# Altium schematic sheet powertrain.SchDoc
size B; DrawnBy: Hoang Pham; Engineer: Hoang Pham; SheetNumber: 2; SheetTotal: 4; DocumentName: powertrain
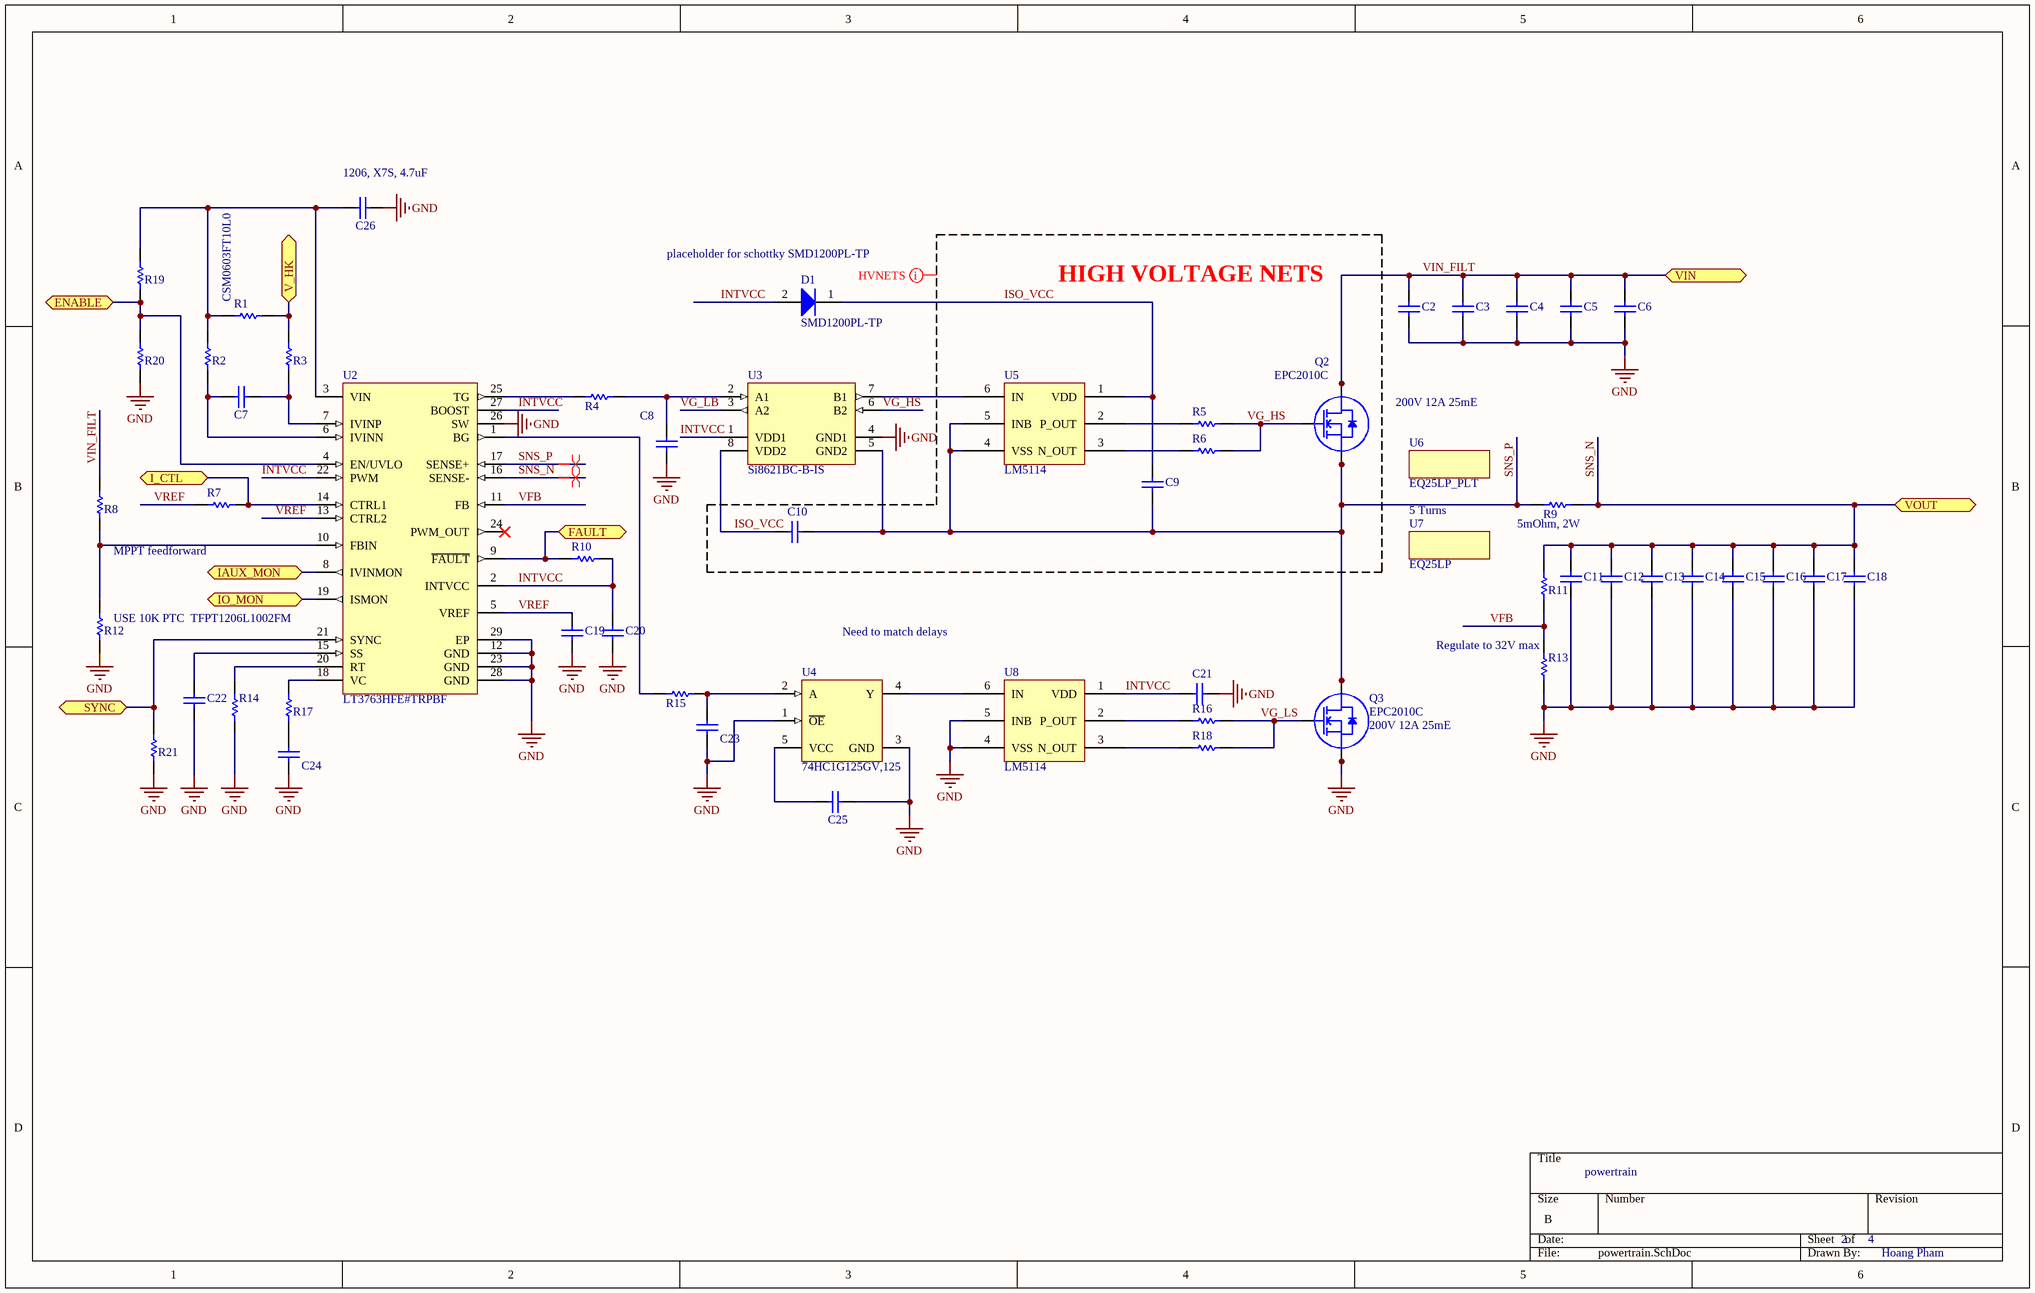
[diagram p0: powertrain.SchDoc]

## Parts
C2  CAP 10nF 200V 0603(1608)  [CAPC0603(1608)100_L]  (value not drawn)
C3  CAP 10nF 200V 0603(1608)  [CAPC0603(1608)100_L]  (value not drawn)
C4  CAP 10nF 200V 0603(1608)  [CAPC0603(1608)100_L]  (value not drawn)
C5  CAP 10nF 200V 0603(1608)  [CAPC0603(1608)100_L]  (value not drawn)
C6  CAP 10nF 200V 0603(1608)  [CAPC0603(1608)100_L]  (value not drawn)
C7  CAP 1uF 10V 0402(1005)  [CAPC0402(1005)60_N]  (value not drawn)
C8  CAP 1pF 10V 0402(1005)  [CAPC0402(1005)60_L]  (value not drawn)
C9  CAP 220nF 10V 0402(1005)  [CAPC0402(1005)60_M]  (value not drawn)
C10  CAP 220nF 10V 0402(1005)  [CAPC0402(1005)60_M]  (value not drawn)
C11  CAP 4.7uF 100V 2220(5750)  [CAPC2220(5750)280_M]  (value not drawn)
C12  CAP 4.7uF 100V 2220(5750)  [CAPC2220(5750)280_M]  (value not drawn)
C13  CAP 4.7uF 100V 2220(5750)  [CAPC2220(5750)280_M]  (value not drawn)
C14  CAP 4.7uF 100V 2220(5750)  [CAPC2220(5750)280_M]  (value not drawn)
C15  CAP 4.7uF 100V 2220(5750)  [CAPC2220(5750)280_M]  (value not drawn)
C16  CAP 4.7uF 100V 2220(5750)  [CAPC2220(5750)280_M]  (value not drawn)
C17  CAP 4.7uF 100V 2220(5750)  [CAPC2220(5750)280_M]  (value not drawn)
C18  CAP 4.7uF 100V 2220(5750)  [CAPC2220(5750)280_M]  (value not drawn)
C19  CAP 2.2uF 10V 0402(1005)  [CAPC0402(1005)60_N]  (value not drawn)
C20  CAP 22uF 10V 0805(2012)  [CAPC0805(2012)145_L]  (value not drawn)
C21  CAP 220nF 10V 0402(1005)  [CAPC0402(1005)60_M]  (value not drawn)
C22  CAP 10nF 10V 0402(1005)  [CAPC0402(1005)60_L]  (value not drawn)
C23  CAP 1pF 10V 0402(1005)  [CAPC0402(1005)60_L]  (value not drawn)
C24  CAP 4.7nF 10V 0402(1005)  [CAPC0402(1005)60_M]  (value not drawn)
C25  CAP 470nF 10V 0402(1005)  [CAPC0402(1005)60_N]  (value not drawn)
C26  CAP 1uF 100V 1206(3216)  [CAPC1206(3216)190_L]  (value not drawn)
D1  SMD1200PL-TP  [ONSC-SOD-123-2-425-04_V]
Q2  EPC2010C  value 200V 12A 25mE  [EPC2x200L]
Q3  EPC2010C  value 200V 12A 25mE  [EPC2x200L]
R1  CSM0603FT10L0  [RESC1608X40X30ML10T10]
R2  1K 1% 0402(1005)  [RESC0402(1005)_L]  (value not drawn)
R3  1K 1% 0402(1005)  [RESC0402(1005)_L]  (value not drawn)
R4  Jumper 0402(1005)  [RESC0402(1005)_N]  (value not drawn)
R5  Jumper 0402(1005)  [RESC0402(1005)_N]  (value not drawn)
R6  Jumper 0402(1005)  [RESC0402(1005)_N]  (value not drawn)
R7  10K 1% 0402(1005)  [RESC0402(1005)_N]  (value not drawn)
R8  475K 1% 0603(1608)  [RESC0603(1608)_M]  (value not drawn)
R9  Jumper 2010(5025)  [RESC2010(5025)_M]  (value not drawn)
R10  47K5 1% 0402(1005)  [RESC0402(1005)_M]  (value not drawn)
R11  255K 1% 0603(1608)  [RESC0603(1608)_N]  (value not drawn)
R12  10K 5% 1206(3216)  [RESC1206(3216)_M]  (value not drawn)
R13  10K 1% 0402(1005)  [RESC0402(1005)_N]  (value not drawn)
R14  90K9 1% 0402(1005)  [RESC0402(1005)_N]  (value not drawn)
R15  Jumper 0402(1005)  [RESC0402(1005)_N]  (value not drawn)
R16  Jumper 0402(1005)  [RESC0402(1005)_N]  (value not drawn)
R17  59K 1% 0402(1005)  [RESC0402(1005)_L]  (value not drawn)
R18  Jumper 0402(1005)  [RESC0402(1005)_N]  (value not drawn)
R19  69R8 1% 0402(1005)  [RESC0402(1005)_M]  (value not drawn)
R20  3K3 5% 0402(1005)  [RESC0402(1005)_L]  (value not drawn)
R21  10K 5% 0402(1005)  [RESC0402(1005)_N]  (value not drawn)
U2  LT3763HFE#TRPBF  [LT-FE-28-EPV-EB_N]
U3  Si8621BC-B-IS  [SLAB-SOIC-8-NB_M]
U4  74HC1G125GV,125  [NXP-SOT753_V]
U5  LM5114
U6  EQ25LP_PLT
U7  EQ25LP
U8  LM5114

## Blocks framed on the sheet
HIGH VOLTAGE NETS: C9 C10 Q2 R5 R6 U5

## Ports
ENABLE, FAULT, I_CTL, IAUX_MON, IO_MON, SYNC, V_HK, VIN, VOUT

## Nets
GND: C2.1 C3.1 C4.1 C5.1 C6.1 C8.1 C11.1 C12.1 C13.1 C14.1 C15.1 C16.1 C17.1 C18.1 C19.1 C20.1 C21.1 C22.1 C23.1 C24.1 C25.2 C26.2 Q3.2(SS) Q3.4(SP1) Q3.6(SP2) R12.1 R13.1 R14.1 R20.1 R21.1 U2.12(GND) U2.23(GND) U2.26(SW) U2.28(GND) U2.29(EP) U3.4(GND1) U4.1(~{OE}) U4.3(GND) U8.4(VSS) U8.5(INB)
ENABLE: R19.1 R20.2 U2.4(EN/UVLO) ; port ENABLE
FAULT: R10.1 U2.9(~{FAULT}) ; port FAULT
I_CTL: R7.1 U2.14(CTRL1) ; port I_CTL
IAUX_MON: U2.8(IVINMON) ; port IAUX_MON
INTVCC: C20.2 C21.2 D1.2(A) R10.2 U2.2(INTVCC) U2.22(PWM) U2.27(BOOST) U3.1(VDD1) U8.1(VDD)
IO_MON: U2.19(ISMON) ; port IO_MON
ISO_VCC: C9.2 C10.2 D1.1(K) U3.8(VDD2) U5.1(VDD)
SNS_N: C11.2 C12.2 C13.2 C14.2 C15.2 C16.2 C17.2 C18.2 R9.2 R11.2 U2.16(SENSE-) ; port VOUT
SNS_P: C9.1 C10.1 Q2.2(SS) Q2.4(SP1) Q2.6(SP2) Q3.3(D1) Q3.5(D2) Q3.7(D3) R9.1 U2.17(SENSE+) U3.5(GND2) U5.4(VSS) U5.5(INB)
SYNC: R21.2 U2.21(SYNC) ; port SYNC
V_HK: R1.2 R3.2 ; port V_HK
VFB: R11.1 R13.2 U2.11(FB)
VG_HS: Q2.1(G) R5.2 R6.2 U3.6(B2)
VG_LB: U3.3(A2)
VG_LS: Q3.1(G) R16.2 R18.2
VIN_FILT: C2.2 C3.2 C4.2 C5.2 C6.2 Q2.3(D1) Q2.5(D2) Q2.7(D3) R8.2 ; port VIN
VREF: C19.2 R7.2 U2.5(VREF) U2.13(CTRL2)
NetC7_1: C7.1 R2.1 U2.6(IVINN)
NetC7_2: C7.2 R3.1 U2.7(IVINP)
NetC8_2: C8.2 R4.2 U3.2(A1)
NetC22_2: C22.2 U2.15(SS)
NetC23_2: C23.2 R15.2 U4.2(A)
NetC24_2: C24.2 R17.1
NetC25_1: C25.1 U4.5(VCC)
NetC26_1: C26.1 R1.1 R2.2 R19.2 U2.3(VIN)
NetR4_1: R4.1 U2.25(TG)
NetR5_1: R5.1 U5.2(P_OUT)
NetR6_1: R6.1 U5.3(N_OUT)
NetR8_1: R8.1 R12.2 U2.10(FBIN)
NetR14_2: R14.2 U2.20(RT)
NetR15_1: R15.1 U2.1(BG)
NetR16_1: R16.1 U8.2(P_OUT)
NetR17_2: R17.2 U2.18(VC)
NetR18_1: R18.1 U8.3(N_OUT)
NetU3_7: U3.7(B1) U5.6(IN)
NetU4_4: U4.4(Y) U8.6(IN)

Not connected (* = marked no-connect by the designer): U2 24(PWM_OUT)*

## Layout directives
differential pair: SNS_N, SNS_P
net class Undefined: (no net found under the mark)

## Notes on the sheet
- (near C26) 1206, X7S, 4.7uF
- (near D1) placeholder for schottky SMD1200PL-TP
- MPPT feedforward
- 5 Turns
- (near R9) 5mOhm, 2W
- (near R12) USE 10K PTC  TFPT1206L1002FM
- Need to match delays
- (near R13) Regulate to 32V max

## Library data of the parts
C2-C6 = CMP-1035-02328-1: CAP 10nF 200V ±10% 0603 (1608 Metric) Thickness 1mm SMD; Case-Metric: 1608; Tolerance: Â±10%; Case-EIA: 0603; Technology: SMT; Rated Voltage: 200 V; Value: 10nF; Max Thickness: 1 mm
C7 = CMP-1034-02116-1: CAP 1uF 10V ±10% 0402 (1005 Metric) Thickness 0.6mm SMD; Tolerance: Â±10%; Case-Metric: 1005; Case-EIA: 0402; Value: 1uF; Technology: SMT; Max Thickness: 0.6 mm; Rated Voltage: 10 V
C8 C23 = CMP-1034-00047-1: CAP 1pF 10V ±0.1pF 0402 (1005 Metric) Thickness 0.6mm SMD; Tolerance: Â±0.1pF; Case-EIA: 0402; Case-Metric: 1005; Value: 1pF; Max Thickness: 0.6 mm; Technology: SMT; Rated Voltage: 10 V
C9 C10 C21 = CMP-1034-02086-1: CAP 220nF 10V ±10% 0402 (1005 Metric) Thickness 0.6mm SMD; Tolerance: Â±10%; Case-Metric: 1005; Case-EIA: 0402; Rated Voltage: 10 V; Technology: SMT; Max Thickness: 0.6 mm; Value: 220nF
C11-C18 = CMP-1042-00761-1: CAP 4.7uF 100V ±20% 2220 (5750 Metric) Thickness 2.8mm SMD; Tolerance: Â±20%; Case-EIA: 2220; Case-Metric: 5750; Max Thickness: 2.8 mm; Rated Voltage: 100 V; Technology: SMT; Value: 4.7uF
C19 = CMP-1034-02127-1: CAP 2.2uF 10V ±10% 0402 (1005 Metric) Thickness 0.6mm SMD; Case-EIA: 0402; Tolerance: Â±10%; Case-Metric: 1005; Technology: SMT; Rated Voltage: 10 V; Value: 2.2uF; Max Thickness: 0.6 mm
C20 = CMP-1036-04942-1: CAP 22uF 10V ±10% 0805 (2012 Metric) Thickness 1.45mm SMD; Case-EIA: 0805; Case-Metric: 2012; Tolerance: Â±10%; Rated Voltage: 10 V; Max Thickness: 1.45 mm; Value: 22uF; Technology: SMT
C22 = CMP-1034-01870-1: CAP 10nF 10V ±5% 0402 (1005 Metric) Thickness 0.6mm SMD; Tolerance: Â±5%; Case-EIA: 0402; Case-Metric: 1005; Value: 10nF; Technology: SMT; Max Thickness: 0.6 mm; Rated Voltage: 10 V
C24 = CMP-1034-01805-1: CAP 4.7nF 10V ±5% 0402 (1005 Metric) Thickness 0.6mm SMD; Tolerance: Â±5%; Case-EIA: 0402; Case-Metric: 1005; Technology: SMT; Value: 4.7nF; Rated Voltage: 10 V; Max Thickness: 0.6 mm
C25 = CMP-1034-02106-1: CAP 470nF 10V ±10% 0402 (1005 Metric) Thickness 0.6mm SMD; Tolerance: Â±10%; Case-EIA: 0402; Case-Metric: 1005; Value: 470nF; Technology: SMT; Rated Voltage: 10 V; Max Thickness: 0.6 mm
C26 = CMP-1037-04729-1: CAP 1uF 100V ±20% 1206 (3216 Metric) Thickness 1.9mm SMD; Case-EIA: 1206; Case-Metric: 3216; Tolerance: Â±20%; Max Thickness: 1.9 mm; Rated Voltage: 100 V; Value: 1uF; Technology: SMT
D1 = CMP-1054-00040-1: High Voltage Switching Diode, 2-Pin SOD-123, Pb-Free, Tape and Reel; Manufacturer: On Semiconductor; PartNumber: MMSD103T1G; IF Max (A): 0.2; Configuration: Single; trr Max (ns): 50; ComponentLink3URL: http://www.onsemi.com/pub_link/Collateral/425-04.PDF; DatasheetVersion: Rev. 6; Packing: Tape and Reel; PackageReference: SOD-123-2-425-04; ComponentLink1Description: Manufacturer URL; ComponentLink2URL: http://www.onsemi.com/pub_link/Collateral/MMSD103T1-D.PDF; PackageDescription: 2-Pin SOD, Body 1.6 x 2.69 mm; ComponentLink2Description: Datasheet; ComponentLink3Description: Package Specification; Mounting Technology: Surface Mount; ComponentLink1URL: http://www.onsemi.com/; RoHS: TRUE; PackageVersion: Rev. G, 10/2009
Q2 Q3 = EPC2010C: 200V 12A 25mE; MFG: EPC; PCBfootprint: EPC2x200L; Config: *; MFGPN: EPC2010
R1 = CMP-1722-00001-2: Chip Resistor, 10 mOhm, +/- 1%, 333 mW, -55 to 155 degC, 0603 (1608 Metric), RoHS, Tape and Reel; Resistance: 10 mOhm; RoHSCompliant: True; Length: 0.063 inch; ComponentLink2URL: https://www.seielect.com/catalog/sei-csm.pdf; PackageDescription: 2-Pin Surface Mount Device, Body 1.6 x 0.8 mm; Mounting Technology: Surface Mount; PartNumber: CSM0603FT10L0; Min Operating Temperature: -55 degC; Width: 0.031 inch; Package Quantity: 1; Case Code (Metric): 1608; ComponentLink1URL: https://www.seielect.com/; Height: 0.016 inch; ComponentLink2Description: Datasheet; Tolerance: 1%; Packaging: Cut Tape; DatasheetVersion: 10/2015; Case Code (Imperial): 0603; Max Operating Temperature: 155 degC; ComponentLink1Description: Manufacturer URL
R2 R3 = CMP-1011-00510-1: 1K 0.063W 1% 0402 (1005 Metric)  SMD; Case-EIA: 0402; Value: 1000.00 Ohm; Case-Metric: 1005; Technology: SMT; Tolerance: 1 %; Power: 0.063 W
R4-R6 R15 R16 R18 = CMP-1011-00001-1: Jumper 0402 (1005 Metric); Tolerance: None; Case-Metric: 1005; Case-EIA: 0402; Value: 0.00 Ohm; Power: None; Technology: SMT
R7 R13 = CMP-1011-00623-1: 10K 0.063W 1% 0402 (1005 Metric)  SMD; Case-Metric: 1005; Value: 10000.00 Ohm; Case-EIA: 0402; Tolerance: 1 %; Technology: SMT; Power: 0.063 W
R8 = CMP-1012-00813-1: 475K 0.1W 1% 0603 (1608 Metric)  SMD; Value: 475000.00 Ohm; Case-Metric: 1608; Case-EIA: 0603; Power: 0.1 W; Technology: SMT; Tolerance: 1 %
R9 = CMP-1017-00001-1: Jumper 2010 (5025 Metric); Case-Metric: 5025; Value: 0.00 Ohm; Case-EIA: 2010; Tolerance: None; Technology: SMT; Power: None
R10 = CMP-1011-00700-1: 47K5 0.063W 1% 0402 (1005 Metric)  SMD; Case-Metric: 1005; Case-EIA: 0402; Value: 47500.00 Ohm; Power: 0.063 W; Technology: SMT; Tolerance: 1 %
R11 = CMP-1012-00780-1: 255K 0.1W 1% 0603 (1608 Metric)  SMD; Case-EIA: 0603; Value: 255000.00 Ohm; Case-Metric: 1608; Tolerance: 1 %; Technology: SMT; Power: 0.1 W
R12 = CMP-1014-00098-1: 10K 0.25W 5% 1206 (3216 Metric)  SMD; Value: 10000.00 Ohm; Case-Metric: 3216; Case-EIA: 1206; Power: 0.25 W; Tolerance: 5 %; Technology: SMT
R14 = CMP-1011-00731-1: 90K9 0.063W 1% 0402 (1005 Metric)  SMD; Case-EIA: 0402; Case-Metric: 1005; Value: 90900.00 Ohm; Tolerance: 1 %; Power: 0.063 W; Technology: SMT
R17 = CMP-1011-00710-1: 59K 0.063W 1% 0402 (1005 Metric)  SMD; Value: 59000.00 Ohm; Case-EIA: 0402; Case-Metric: 1005; Power: 0.063 W; Technology: SMT; Tolerance: 1 %
R19 = CMP-1011-00380-1: 69R8 0.063W 1% 0402 (1005 Metric)  SMD; Case-Metric: 1005; Value: 69.80 Ohm; Case-EIA: 0402; Tolerance: 1 %; Technology: SMT; Power: 0.063 W
R20 = CMP-1011-00086-1: 3K3 0.063W 5% 0402 (1005 Metric)  SMD; Case-EIA: 0402; Value: 3300.00 Ohm; Case-Metric: 1005; Power: 0.063 W; Technology: SMT; Tolerance: 5 %
R21 = CMP-1011-00098-1: 10K 0.063W 5% 0402 (1005 Metric)  SMD; Case-Metric: 1005; Value: 10000.00 Ohm; Case-EIA: 0402; Technology: SMT; Tolerance: 5 %; Power: 0.063 W
U2 = CMP-0477-00170-1: 60 V High Current Step-Down LED Driver Controller, 6 to 60 V Vin, 55 V Vout MAX, 28-pin SOP (FE-28-EPV-EB), -40 to 150 degC, Pb-Free, Tape and Reel; Manufacturer: Linear Technology; Vin Min(V): 6; Topology: Buck, LED Driver; PackageDescription: 28-Pin Plastic TSSOP, Body 9.7 x 4.4 mm, Pitch 0.65 mm; ComponentLink3Description: Package Specification; PartNumber: LT3763HFE#TRPBF; DatasheetVersion: Rev. A; RoHS: TRUE; PackageVersion: Rev. J, 11/2012; Packing: Tape and Reel; PackageReference: FE-28; ComponentLink2Description: Datasheet; Mounting Technology: Surface Mount; ComponentLink1Description: Manufacturer URL; ComponentLink3URL: http://cds.linear.com/docs/en/packaging/05081663__J_FE28(EB).pdf; ComponentLink1URL: http://www.linear.com/; ComponentLink2URL: http://cds.linear.com/docs/en/datasheet/3763fa.pdf
U3 = CMP-0512-00404-1: Low-Power Single and Dual-Channel Digital Isolator, 150 Mbps, 3.75 kVRMS Isolation Rating, -40 to 125 degC, 8-pin SOIC; Manufacturer: Silicon Labs; Maximum Data Rate (Mbps): 150; Channel Type: Unidirectional; 10kV surge: FALSE; Sub-Family: Isolators; Isolation Rating (kV): 3.75; Maximum Propagation Delay (ns): 13; Enable Control: TRUE; PartNumber: Si8621BC-B-IS; Mounting Technology: Surface Mount; ComponentLink1Description: Manufacturer URL; ComponentLink1URL: http://www.silabs.com/; ComponentLink2Description: Datasheet; DatasheetVersion: Rev. 1.3; ComponentLink3Description: Package Specification; ComponentLink2URL: http://www.silabs.com/Support%20Documents/TechnicalDocs/Si861x-2x.pdf; PackageReference: SOIC-8-NB; AEC-Q100: FALSE; ComponentLink3URL: http://www.silabs.com/Support%20Documents/TechnicalDocs/Si8220-21.pdf; PackageDescription: 8-Pin Narrow Body Plastic Small Outline, Body 4.9 x 3.9 mm, Pitch 1.27 mm
U4 = CMP-1328-00003-1: High-Speed, Si-Gate CMOS Device, 2 to 6 V, -40 to 125 degC, 5-Pin SC-74A (SOT753), RoHS, Reel; Manufacturer: NXP Semiconductors; VI: 0 to 6 V; VCC: 2 to 6 V; CPD: 30 pF Typ.; Ci: 1.5 pF Typ.; PackageDescription: 5-Pin Plastic Surface Mounted Package, Body 2.9 x 1.5 mm, Pitch 0.95 mm; ComponentLink1URL: http://www.nxp.com/; ComponentLink3URL: http://www.nxp.com/documents/outline_drawing/sot753_po.pdf; DatasheetVersion: Rev. 05; RoHS: TRUE; VO: 0 to 6 V; Mounting Technology: Surface Mount; Temperature Range: -40 to 125 degC; ComponentLink1Description: Manufacturer URL; PackageVersion: Mar-06; ComponentLink2URL: http://www.nxp.com/documents/data_sheet/74HC_HCT1G125.pdf; ComponentLink2Description: Datasheet; ComponentLink3Description: Package Specification; Packing: Reel; PartNumber: 74HC1G125GV,125